# EAGLE schematic Board_4_Buttons (EAGLE 9.6.2)
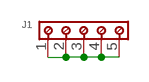
[diagram p0: schematic, sheet 1]

## Parts
J1  691508110305  [691508110305]

## Nets
N$1: J1.1 J1.2 J1.3 J1.4 J1.5

## Library data of the parts
J1 = Wurth_Connectors_WR-TBL Rising Cage Clamp:691508110305: WR-TBL Serie 5081 - 3.50 mm Horizontal entry SMT Pressure Clamp KIND PROPERTIES Pitch 3.5 mm MATERIAL PROPERTIES Insulator Material LCP Insulator Flammability Rating UL94 V-0 Insulator Color Black Contact Material Brass Contact Plating Copper over Zinc Terminal Screw Material Steel Terminal Screw Plating Zinc Wire Guard Material Brass GENERAL INFORMATION Operating Temperature -40 up to +130 °C Compliance RoHS ELECTRICAL PROPERTIES IR UL 10 A Working Voltage [UL] 300 V (AC) Withstanding Voltage [UL] 1600 V (AC) Withstanding Voltage [cULus] 1600 V (AC) Contact Resistance [UL] 20 mΩ Contact Resistance [cULus] 20 mΩ MECHANICAL PROPERTIES Wire Strip Length 4 up to 5 (mm) Screw M2 Solid Wire Section (AWG) 30 to 16 (AWG) Solid Wire Section (Metric) 0.05 to 1.31 (mm²) Stranded Wire Section (AWG) 30 to 16 (AWG) Stranded Wire Section (Metric) 0.05 to 1.31 (mm²) CERTIFICATION cULus Approval E315414 UL Approval E315414 PACKAGING PROPERTIES Packaging Tape and Reel with Cap <https://katalog.we-online.com/media/images/v2/o58319v209%20Family_WR-TBL_Serie_5081_6915081103xx.jpg> Details see: https://katalog.we-online.com/en/em/TBL_3_50_5081_6915081103XX Updated by Ella Wu 2019-11-12 2019(C) Wurth Elektronik; DATASHEET-URL: https://www.we-online.com/catalog/datasheet/691508110305.pdf; IR-UL: 10A; MOUNT: THT; PART-NUMBER: 691508110305; PINS: 5; PITCH: 3.5mm; TYPE: Horizontal; WIRE: 30 to 16 (AWG) 0.05 to 1.31 (mm²); WORKING-VOLTAGE-UL: 300V (AC)